# Altium schematic sheet 3EWL1-200001_03.SchDoc: Lantern USB-PowerPort
size A4; Engineer: cronos; Revision: 6A1.0; SheetNumber: 3; SheetTotal: 5
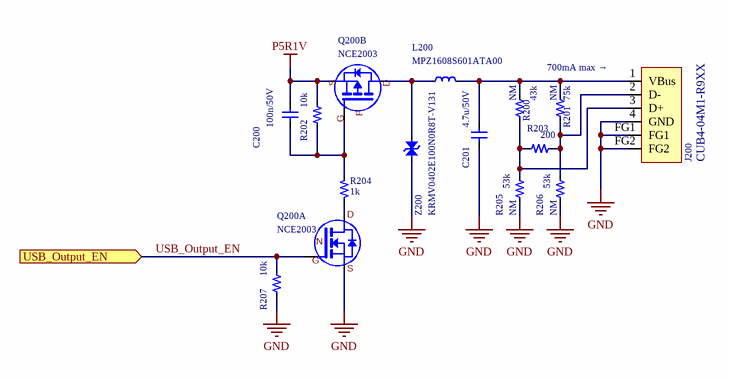
[diagram p0: 3EWL1-200001_03.SchDoc]

## Parts
C200  100n/50V  [SC2-1.00X0.50A]
C201  4.7u/50V  [SC2-3.20X1.60A]
J200  CUB4-04M1-R9XX  [CUB4-04M1-R9XX]
L200  MPZ1608S601ATA00  [SL2-1.60X0.80A]
Q200  NCE2003  [SOT23-6]  (parts A,B of 2)
R200  Mounting: NM  [SR2-1.00X0.50A]  (hidden comment: 43k)
R201  Mounting: NM  [SR2-1.00X0.50A]  (hidden comment: 75k)
R202  10k  [SR2-1.00X0.50A]
R203  200  [SR2-1.00X0.50A]
R204  1k  [SR2-1.00X0.50A]
R205  Mounting: NM  [SR2-1.00X0.50A]  (hidden comment: 53k)
R206  Mounting: NM  [SR2-1.00X0.50A]  (hidden comment: 53k)
R207  10k  [SR2-1.00X0.50A]
Z200  KRMV0402E100N0R8T-V131  [SR2-1.00X0.50A]

## Ports
USB_Output_EN (in)

## Nets
GND: C201.1 J200.4(GND) J200.FG1 J200.FG2 Q200.5(N_S) R205.2 R206.2 R207.2 Z200.1
P5R1V: C200.1 Q200.2(P_S) R202.1
USB_Output_EN: Q200.1(N_G) R207.1 ; port USB_Output_EN
NetC200_2: C200.2 Q200.3(P_G) R202.2 R204.2
NetC201_2: C201.2 J200.1(VBus) L200.2 R200.1 R201.1
NetJ200_2: J200.2(D-) R201.2 R203.2 R206.1
NetJ200_3: J200.3(D+) R200.2 R203.1 R205.1
NetL200_1: L200.1 Q200.4(P_D) Z200.2
NetQ200_6: Q200.6(N_D) R204.1

## Notes on the sheet
- 700mA max →
- Model
- Title
- Rev.
- Size
- Filename
- Comment
- Date
- Design
- A4
- Sheet          of
- (in symbol NCE2003, part A) D; N; G; S
- (in symbol NCE2003, part B) S; D; P; G

## Library data of the parts
C200 = C: 100n, 50V, X7R, 1005Size; Manufacturer: Walsin; Manufacturer Part Number: 0402B104K500CT; Description 1: Capacitor (non-polar); Commodity: MLCC; Replace: OK; FirstPublished: 2012/10/14; LatestRevisionDate: *; LatestRevisionNote: *; Mounting: *; Description 2: *; Footprint(imperial): 0402; Footprint(metric): 1005; Value: 100n/50V
C201 = C: 4.7u/50V, X7R, 3216Size; Manufacturer: Murata; Manufacturer Part Number: GRM31CR71H475KA12L; Commodity: MLCC; Replace: OK; Mounting: *; Footprint(imperial): 1206; Footprint(metric): 3216; Value: 4.7u/50V
J200 = CUB4-04M1-R9XX: USB-A; Manufacturer: Youte Electronic; Replace: OK; Value: CUB4-04M1-R9XX; Mounting: *; Manufacturer Part Number: CUB4-04M1-R9XX
L200 = L: 600ohm/1.0A/150mohm; Manufacturer: TDK; Commodity: RFC; Replace: OK; FirstPublished: 2012/10/14; LatestRevisionDate: *; LatestRevisionNote: *; PackageReference: *; Manufacturer Part Number: MPZ1608S601ATA00; Mounting: *; Footprint(imperial): '0603; Footprint(metric): 1608; Value: 600ohm/1.0A/150mohm
Q200 = NCE2003: N(20V, 55mohm, Vgs(th)=1.2V ), P(-20V, 100mohm, Vgs(th)=-1V), SOT23-6; Manufacturer: ncepower; Commodity: MOSFET; Replace: OK; Mounting: *; Manufacturer Part Number: NCE2003; Value: NCE2003
R200 = R: Manufacturer: YAGEO; Manufacturer Part Number: RC0402FR-0743KL; Description 1: Resistor; Replace: OK; FirstPublished: 2012/10/14; LatestRevisionDate: *; LatestRevisionNote: *; PackageReference: *; Description 2: *; Value: 43k; Commodity: Resistor; Footprint(imperial): 0402; Footprint(metric): 1005
R201 = R: Manufacturer: YAGEO; Manufacturer Part Number: RC0402FR-0775KL; Description 1: Resistor; Replace: OK; FirstPublished: 2012/10/14; LatestRevisionDate: *; LatestRevisionNote: *; PackageReference: *; Description 2: *; Value: 75k; Commodity: Resistor; Footprint(imperial): 0402; Footprint(metric): 1005
R202 R207 = R: Manufacturer: YAGEO; Manufacturer Part Number: RC0402FR-0710KL; Description 1: Resistor; Replace: OK; FirstPublished: 2012/10/14; LatestRevisionDate: *; LatestRevisionNote: *; PackageReference: *; Mounting: *; Description 2: *; Value: 10k; Commodity: Resistor; Footprint(imperial): 0402; Footprint(metric): 1005
R203 = R: Manufacturer: YAGEO; Manufacturer Part Number: RC0402FR-07200RL; Description 1: Resistor; Replace: OK; FirstPublished: 2012/10/14; LatestRevisionDate: *; LatestRevisionNote: *; PackageReference: *; Mounting: *; Description 2: *; Value: 200; Commodity: Resistor; Footprint(imperial): 0402; Footprint(metric): 1005
R204 = R: Rsisiter 2pin; Manufacturer: Yageo; Manufacturer Part Number: RC0402FR-071KL; Description 1: Resistor; Replace: OK; FirstPublished: 2012/10/14; LatestRevisionDate: *; LatestRevisionNote: *; Mounting: *; Description 2: *; Commodity: Resistor; Footprint(imperial): 0402; Footprint(metric): 1005; Value: 1k
R205 R206 = R: Manufacturer: YAGEO; Manufacturer Part Number: RC0402FR-0753KL; Description 1: Resistor; Replace: OK; FirstPublished: 2012/10/14; LatestRevisionDate: *; LatestRevisionNote: *; PackageReference: *; Description 2: *; Value: 53k; Commodity: Resistor; Footprint(imperial): 0402; Footprint(metric): 1005
Z200 = EZA-EG3A50AV: ESD Suppressor; Manufacturer: GRACE; Description 2: SUPPRESSOR ESD 10V 0402; Replace: NG; FirstPublished: 2012/10/14; LatestRevisionDate: *; LatestRevisionNote: *; PackageReference: 1005; PackageDescription: SZ2-1.00X0.50A; Manufacturer Part Number: KRMV0402E100N0R8T-V131; Mounting: *; Description 1: ESD Suppressor; Value: KRMV0402E100N0R8T-V131; Footprint(imperial): 0402; Footprint(metric): 1005; Commodity: ESD Suppressor